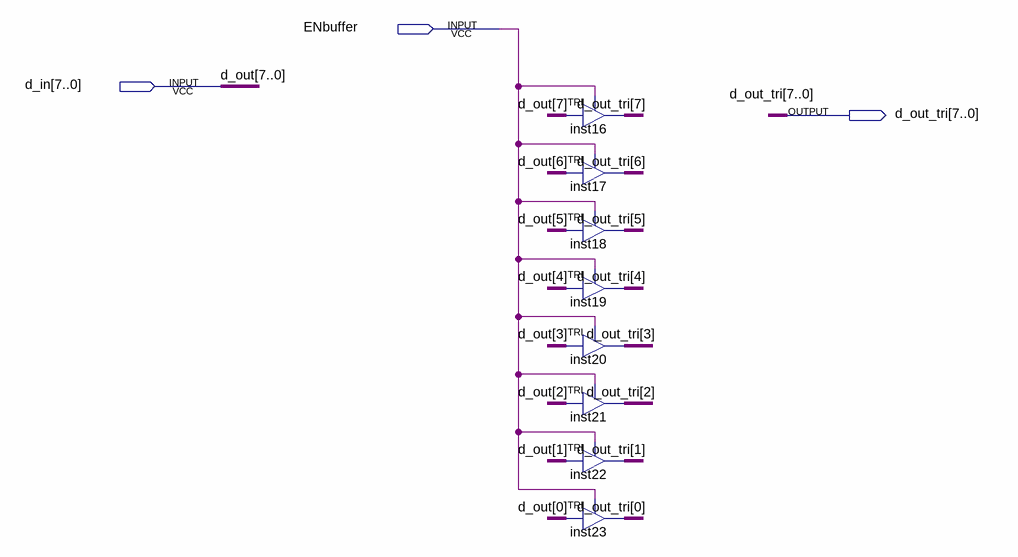
[diagram p0: schematic sheet]
// Quartus schematic Tri_Buffer_8b.bdf as structural Verilog: 8 symbols, 3 pins
module Tri_Buffer_8b (
  input  ENbuffer,
  input  [7:0] d_in,
  output [7:0] d_out_tri
);

  TRI inst16 (.IN(d_in[7]), .OE(ENbuffer), .OUT(d_out_tri[7]));
  TRI inst17 (.IN(d_in[6]), .OE(ENbuffer), .OUT(d_out_tri[6]));
  TRI inst18 (.IN(d_in[5]), .OE(ENbuffer), .OUT(d_out_tri[5]));
  TRI inst19 (.IN(d_in[4]), .OE(ENbuffer), .OUT(d_out_tri[4]));
  TRI inst20 (.IN(d_in[3]), .OE(ENbuffer), .OUT(d_out_tri[3]));
  TRI inst21 (.IN(d_in[2]), .OE(ENbuffer), .OUT(d_out_tri[2]));
  TRI inst22 (.IN(d_in[1]), .OE(ENbuffer), .OUT(d_out_tri[1]));
  TRI inst23 (.IN(d_in[0]), .OE(ENbuffer), .OUT(d_out_tri[0]));

  // Other names for the same wires on the sheet: d_out[7:0] = d_in
endmodule
